# EAGLE design L289 (EAGLE 7.6.0)
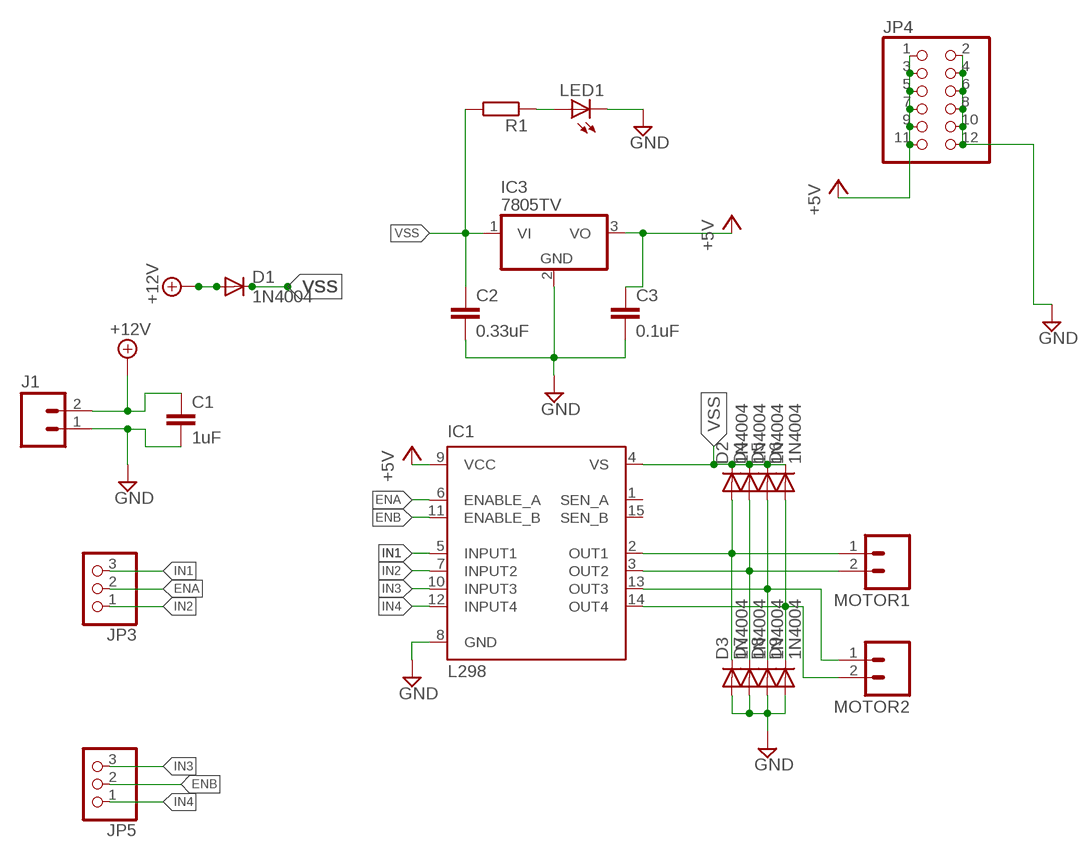
[diagram p0: schematic, sheet 1]

## Parts
C1  1uF  C-EU050-024X044  [C050-024X044]
C2  0.33uF  C-EU050-024X044  [C050-024X044]
C3  0.1uF  C-EU050-024X044  [C050-024X044]
D1  1N4004  [DO41-10]
D2  1N4004  [DO41-10]
D3  1N4004  [DO41-10]
D4  1N4004  [DO41-10]
D5  1N4004  [DO41-10]
D6  1N4004  [DO41-10]
D7  1N4004  [DO41-10]
D8  1N4004  [DO41-10]
D9  1N4004  [DO41-10]
IC1  L298  [MULTIWATT-15]
IC3  7805TV  [TO220V]
J1  M02-JST-2-PTH-NO_SILK  [JST-2-PTH-NS]
JP3  PINHD-1X3  [1X03]
JP4  PINHD-2X6  [2X06]
JP5  PINHD-1X3  [1X03]
LED1  LED3MM  [LED3MM]
MOTOR1  M02-JST-2-PTH-NO_SILK  [JST-2-PTH-NS]
MOTOR2  M02-JST-2-PTH-NO_SILK  [JST-2-PTH-NS]
R1  R-EU_0207/5V  [0207/5V]

## Nets
+5V: C3.1 IC1.9(VCC) IC3.3(VO) JP4.1 JP4.3 JP4.5 JP4.7 JP4.9 JP4.11
+12V: C1.1 D1.A J1.2
ENA: IC1.6(ENABLE_A) JP3.2
ENB: IC1.11(ENABLE_B) JP5.2
GND: C1.2 C2.2 C3.2 D3.A D7.A D8.A D9.A IC1.8(GND) IC3.2(GND) J1.1 JP4.2 JP4.4 JP4.6 JP4.8 JP4.10 JP4.12 LED1.K(C)
IN1: IC1.5(INPUT1) JP3.3
IN2: IC1.7(INPUT2) JP3.1
IN3: IC1.10(INPUT3) JP5.3
IN4: IC1.12(INPUT4) JP5.1
N$1: D2.A D3.C IC1.2(OUT1) MOTOR1.1
N$2: D4.A D7.C IC1.3(OUT2) MOTOR1.2
N$3: D5.A D8.C IC1.13(OUT3) MOTOR2.1
N$4: D6.A D9.C IC1.14(OUT4) MOTOR2.2
N$5: LED1.A R1.1
VSS: C2.1 D1.C D2.C D4.C D5.C D6.C IC1.4(VS) IC3.1(VI) R1.2
Unconnected: IC1.1(SEN_A) IC1.15(SEN_B)

## Library data of the parts
C1-C3 = resistor:C-EU: CAPACITOR, European symbol
D1-D9 = adafruit:1N4004: DIODE General purpose 1N400x type rectifier (With bigger pads) http://www.ladyada.net/library/pcb/eaglelibrary.html
IC1 = st-microelectronics:L298: DUAL FULL-BRIDGE DRIVER; MPN: L298N; OC_FARNELL: 1589425; OC_NEWARK: 32M1527
IC3 = linear:78*: Positive VOLTAGE REGULATOR Source: http://cache.national.com/ds/LM/LM78L05.pdf http://www.fairchildsemi.com/ds/LM/LM7805.pdf
J1 MOTOR1 MOTOR2 = SparkFun-Connectors:M02: Standard 2-pin 0.1" header. Use with - straight break away headers ( PRT-00116) - right angle break away headers (PRT-00553) - swiss pins (PRT-00743) - machine pins (PRT-00117) - female headers (PRT-00115) Molex polarized connector foot print use with: PRT-08233 with associated crimp pins and housings. 2.54_SCREWTERM for use with PRT-10571. 3.5mm Screw Terminal footprints for PRT-08084 5mm Screw Terminal footprints for use with PRT-08432
JP3 JP5 = pinhead:PINHD-1X3: PIN HEADER
JP4 = pinhead:PINHD-2X6: PIN HEADER
LED1 = led:LED: LED OSRAM: - CHIPLED LG R971, LG N971, LY N971, LG Q971, LY Q971, LO R971, LY R971 LH N974, LH R974 LS Q976, LO Q976, LY Q976 LO Q996 - Hyper CHIPLED LW Q18S LB Q993, LB Q99A, LB R99A - SideLED LS A670, LO A670, LY A670, LG A670, LP A670 LB A673, LV A673, LT A673, LW A673 LH A674 LY A675 LS A676, LA A676, LO A676, LY A676, LW A676 LS A679, LY A679, LG A679 - Hyper Micro SIDELED® LS Y876, LA Y876, LO Y876, LY Y876 LT Y87S - SmartLED LW L88C, LW L88S LB L89C, LB L89S, LG L890 LS L89K, LO L89K, LY L89K LS L896, LA L896, LO L896, LY L896 - TOPLED LS T670, LO T670, LY T670, LG T670, LP T670 LSG T670, LSP T670, LSY T670, LOP T670, LYG T670 LG T671, LOG T671, LSG T671 LB T673, LV T673, LT T673, LW T673 LH T674 LS T676, LA T676, LO T676, LY T676, LB T676, LH T676, LSB T676, LW T676 LB T67C, LV T67C, LT T67C, LS T67K, LO T67K, LY T67K, LW E67C LS E67B, LA E67B, LO E67B, LY E67B, LB E67C, LV E67C, LT E67C LW T67C LS T679, LY T679, LG T679 LS T770, LO T770, LY T770, LG T770, LP T770 LB T773, LV T773, LT T773, LW T773 LH T774 LS E675, LA E675, LY E675, LS T675 LS T776, LA T776, LO T776, LY T776, LB T776 LHGB T686 LT T68C, LB T68C - Hyper Mini TOPLED® LB M676 - Mini TOPLED Santana® LG M470 LS M47K, LO M47K, LY M47K Source: http://www.osram.convergy.de LUXEON: - LUMILED® LXK2-PW12-R00, LXK2-PW12-S00, LXK2-PW14-U00, LXK2-PW14-V00 LXK2-PM12-R00, LXK2-PM12-S00, LXK2-PM14-U00 LXK2-PE12-Q00, LXK2-PE12-R00, LXK2-PE12-S00, LXK2-PE14-T00, LXK2-PE14-U00 LXK2-PB12-K00, LXK2-PB12-L00, LXK2-PB12-M00, LXK2-PB14-N00, LXK2-PB14-P00, LXK2-PB14-Q00 LXK2-PR12-L00, LXK2-PR12-M00, LXK2-PR14-Q00, LXK2-PR14-R00 LXK2-PD12-Q00, LXK2-PD12-R00, LXK2-PD12-S00 LXK2-PH12-R00, LXK2-PH12-S00 LXK2-PL12-P00, LXK2-PL12-Q00, LXK2-PL12-R00 Source: www.luxeon.com KINGBRIGHT: KA-3528ASYC Source: www.kingbright.com
R1 = resistor:R-EU_: RESISTOR, European symbol

## Board
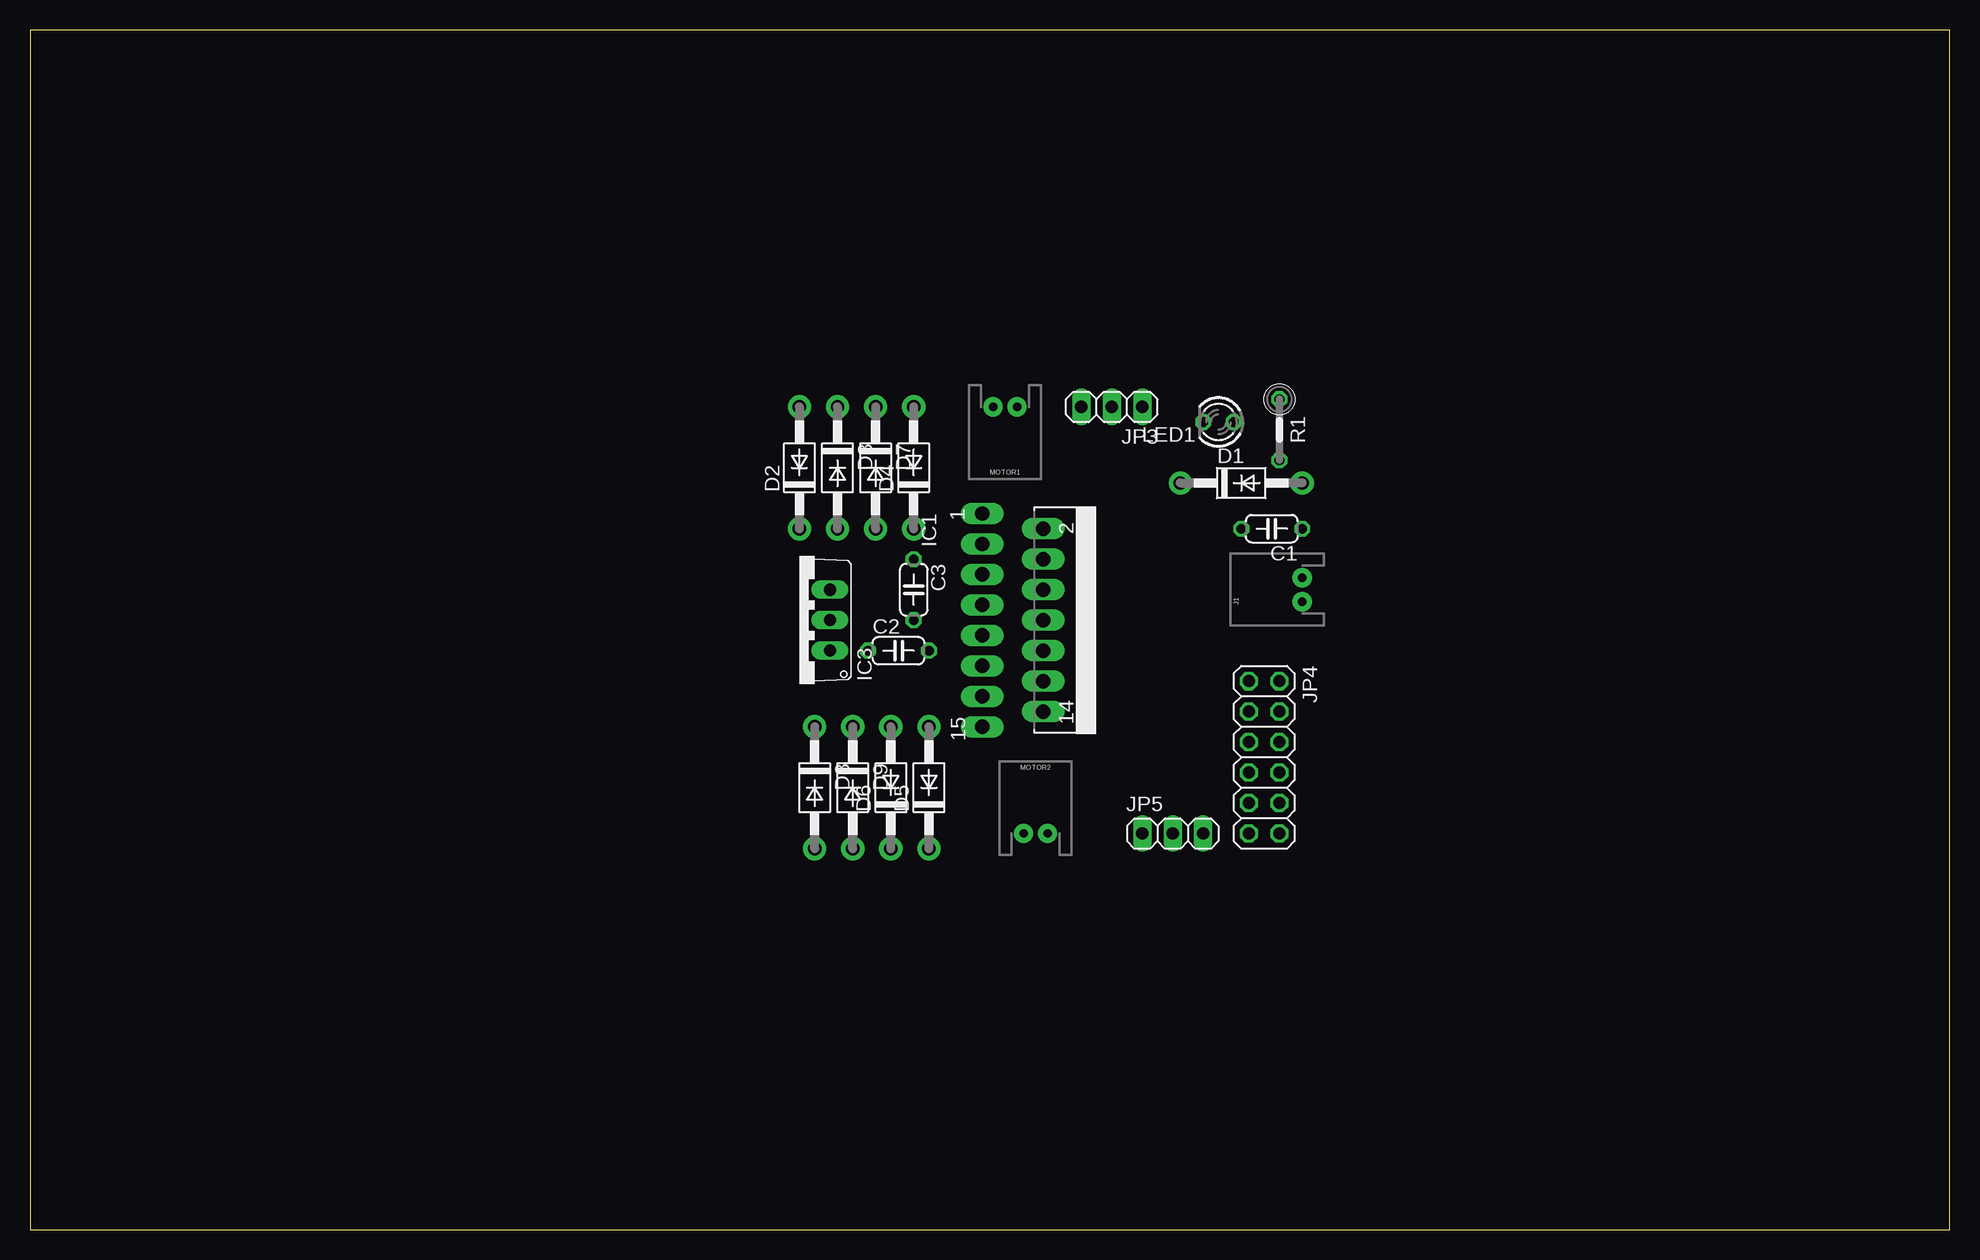
[diagram p1: board, top side]
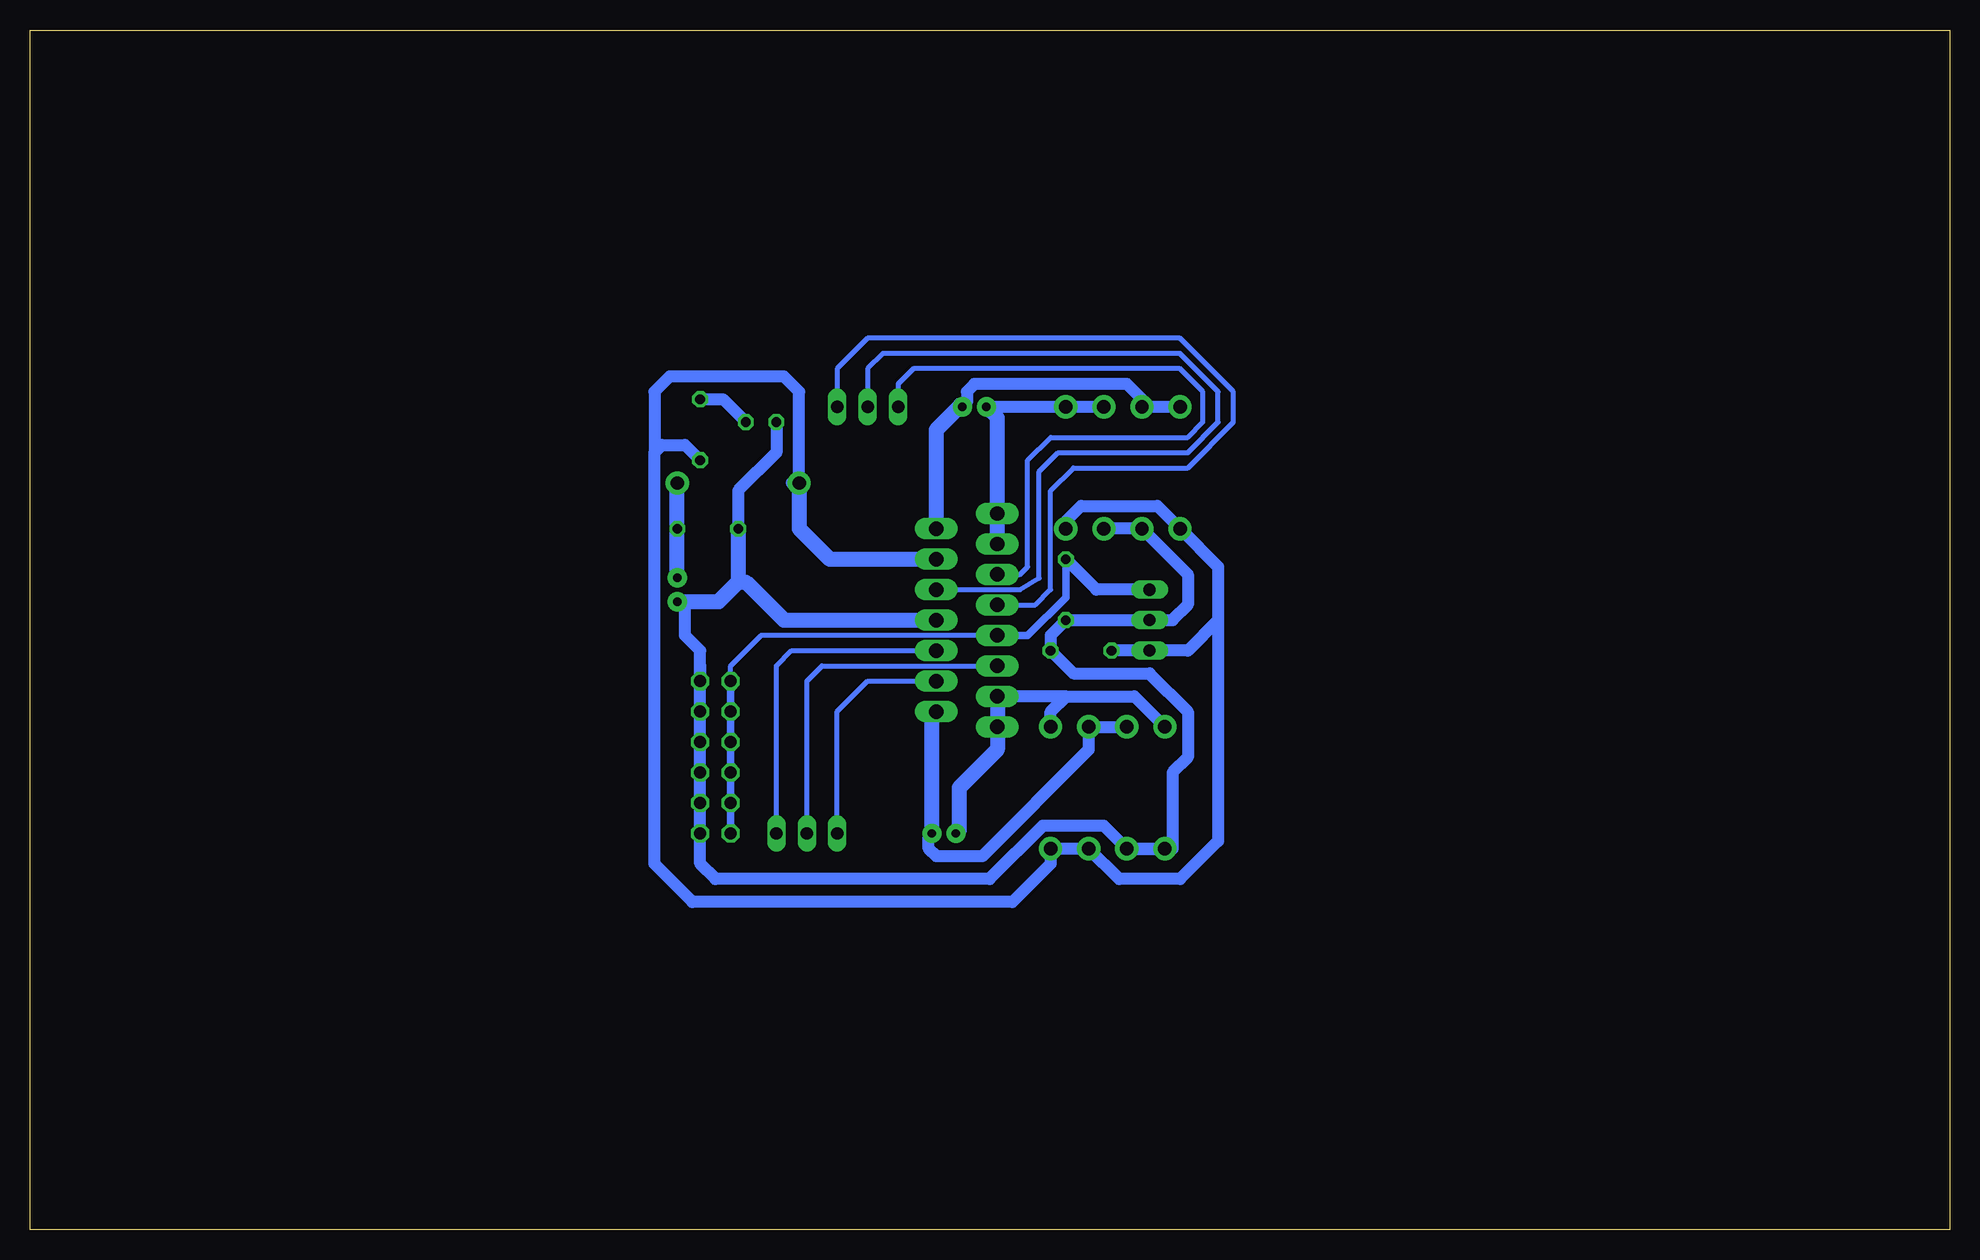
[diagram p2: board, bottom side, seen from below]

Size 160 x 100 mm. Coordinates in mm from the lower left corner, seen from the top.
Outline: 0,0 160,0 160,100 0,100 0,0
Copper layers (1*16): Top 0.035mm / dielectric 1.5mm / Bottom 0.035mm
Design rules "default": minimum track width 10mil, minimum drill 24mil, track to track 8mil, track to pad 8mil, pad to pad 8mil, via to via 8mil, smd to smd 8mil, copper to edge 40mil, drill to drill 8mil, minimum pad ring 10mil, minimum via ring 8mil, stop-mask expansion 4mil, vias tented up to drill 0mil, thermal gap 10mil

### Footprints (pad centres in the part's own frame; a part is rotated, then mirrored left to right if it is on the bottom)
C050-024X044 = drill 0.813 octagon: 1 -2.54,0; 2 2.54,0
DO41-10 = drill 1.118 pad 1.93: A 5.08,0; C -5.08,0
MULTIWATT-15 = drill 1.2 long: 1 -8.89,-7.62; 2 -7.62,-2.54; 3 -6.35,-7.62; 4 -5.08,-2.54; 5 -3.81,-7.62; 6 -2.54,-2.54; 7 -1.27,-7.62; 8 0,-2.54; 9 1.27,-7.62; 10 2.54,-2.54; 11 3.81,-7.62; 12 5.08,-2.54; 13 6.35,-7.62; 14 7.62,-2.54; 15 8.89,-7.62
TO220V = drill 1.016 long: 1 -2.54,-2.54; 2 0,-2.54; 3 2.54,-2.54
JST-2-PTH-NS = drill 0.7 pad 1.6: 1 -1,0; 2 1,0
1X03 = drill 1.016 long: 1 -2.54,0; 2 0,0; 3 2.54,0
2X06 = drill 1.016 octagon: 1 -6.35,-1.27; 2 -6.35,1.27; 3 -3.81,-1.27; 4 -3.81,1.27; 5 -1.27,-1.27; 6 -1.27,1.27; 7 1.27,-1.27; 8 1.27,1.27; 9 3.81,-1.27; 10 3.81,1.27; 11 6.35,-1.27; 12 6.35,1.27
LED3MM = drill 0.813 octagon: A -1.27,0; K 1.27,0
0207/5V = drill 0.813 octagon: 1 -2.54,0; 2 2.54,0

### Placement (x,y rotation side)
C1  103.5,58.42 180 top
C2  72.39,48.26 0 top
C3  73.66,53.34 270 top
D1  100.97,62.23 0 top
D2  64.14,63.5 90 top
D3  67.31,63.5 270 top
D4  73.66,63.5 90 top
D5  74.93,36.83 90 top
D6  71.75,36.83 90 top
D7  70.48,63.5 270 top
D8  65.41,36.83 270 top
D9  68.58,36.83 270 top
IC1  87,50.8 270 top
IC3  64.14,50.8 90 top
J1  106.05,53.34 90 top
JP3  90.17,68.58 180 top
JP4  102.87,39.37 270 top
JP5  95.25,33.02 0 top
LED1  99.06,67.31 180 top
MOTOR1  81.28,68.58 180 top
MOTOR2  83.82,33.02 0 top
R1  104.14,66.67 270 top

### Tracks (layer width: path | path; a pad name or v marks a point on that pad's centre or on a via)
+5V
  Bottom 0.406: IC1.9 99.06,49.53 101.6,46.99 JP4.1
  Bottom 0.61: IC1.9 76.83,49.53 73.66,52.7 C3.1 | JP4.1 JP4.3 JP4.5 JP4.7 JP4.9 JP4.11
  Bottom 1.016: IC3.3 71.12,53.34 C3.1
+12V
  Bottom 1.27: J1.2 C1.1 D1.A
ENA
  Bottom 0.406: IC1.6 77.47,53.34 75.88,54.29 75.88,63.18 74.3,64.77 63.5,64.77 60.96,67.31 60.96,69.85 64.14,73.03 88.9,73.03 90.17,71.75 JP3.2
ENB
  Bottom 0.406: JP5.2 95.25,45.72 93.98,46.99 IC1.11
GND
  Bottom 1.016: D9.A D8.A | C3.2 74.93,49.53 C2.2 73.03,46.35 66.67,46.35 63.5,43.18 63.5,39.37 64.77,38.1 64.77,31.75 D9.A | C3.2 IC3.2 | C3.2 64.77,50.8 63.5,52.07 63.5,54.61 D3.A D7.A | LED1.K 97.79,64.77 100.97,61.59 C1.2 | D9.A 70.48,33.66 75.56,33.66 80.01,29.21 102.87,29.21 104.14,30.48 JP4.12 JP4.10 JP4.8 JP4.6 JP4.4 JP4.2 | 104.14,46.99 JP4.2 | JP4.2 104.14,48.26 105.41,49.53 105.41,51.7 J1.1
  Bottom 1.27: J1.1 102.6,52.34 100.97,53.98 | C1.2 100.97,53.98 | 100.97,53.98 100.33,53.98 97.16,50.8 IC1.8
IN1
  Bottom 0.406: IC1.5 77.47,54.61 76.83,55.24 76.83,64.14 74.93,66.04 63.5,66.04 62.23,67.31 62.23,69.85 64.14,71.75 86.36,71.75 87.63,70.48 JP3.3
IN2
  Bottom 0.406: IC1.7 76.2,52.07 74.93,53.34 74.93,61.59 73.03,63.5 63.5,63.5 59.69,67.31 59.69,69.85 64.14,74.3 90.17,74.3 92.71,71.75 JP3.1
IN3
  Bottom 0.406: JP5.3 97.79,46.99 96.52,48.26 IC1.10
IN4
  Bottom 0.406: JP5.1 92.71,43.18 90.17,45.72 IC1.12
N$1
  Bottom 1.016: 82.55,68.85 MOTOR1.1 81.92,68.94 81.92,69.85 81.28,70.48 68.58,70.48 67.31,69.22 D3.C D2.A
  Bottom 1.27: IC1.2 84.45,66.67 82.55,68.58 MOTOR1.1
N$2
  Bottom 1.016: D7.C D4.A MOTOR1.2
  Bottom 1.27: IC1.3 79.38,67.67 MOTOR1.2
N$3
  Bottom 1.016: D5.A 74.93,43.18 73.66,44.45 | 73.66,44.45 67.94,44.45 D8.C | 73.66,44.45 IC1.13
  Bottom 1.27: IC1.13 79.38,40.01 82.55,36.83 82.55,33.29 MOTOR2.1
N$4
  Bottom 1.016: D9.C D6.A 71.75,40.01 80.64,31.11 84.45,31.11 85.09,31.75 85.09,32.75 MOTOR2.2
  Bottom 1.27: MOTOR2.2 84.82,42.81 IC1.14
N$5
  Bottom 1.016: R1.1 102.23,69.22 LED1.A
VSS
  Bottom 1.016: 95.89,61.59 96.52,62.23 95.89,62.87 95.89,69.85 97.16,71.12 106.68,71.12 107.95,69.85 107.95,64.77 | 107.95,64.77 107.95,30.48 104.78,27.3 78.11,27.3 74.93,30.48 D5.C D6.C 69.22,29.21 64.14,29.21 60.96,32.38 60.96,50.8 | 107.95,64.77 107.31,65.41 105.41,65.41 R1.2 | 60.96,50.8 63.5,48.26 IC3.1 C2.1 | D4.C 73.66,59.05 72.39,60.33 66.04,60.33 D2.C 60.96,55.24 60.96,50.8
  Bottom 1.27: D1.C 95.89,61.59 95.89,58.42 93.34,55.88 IC1.4 83.82,55.88